# EAGLE design led_flasher_v1 (EAGLE 7.1.0)
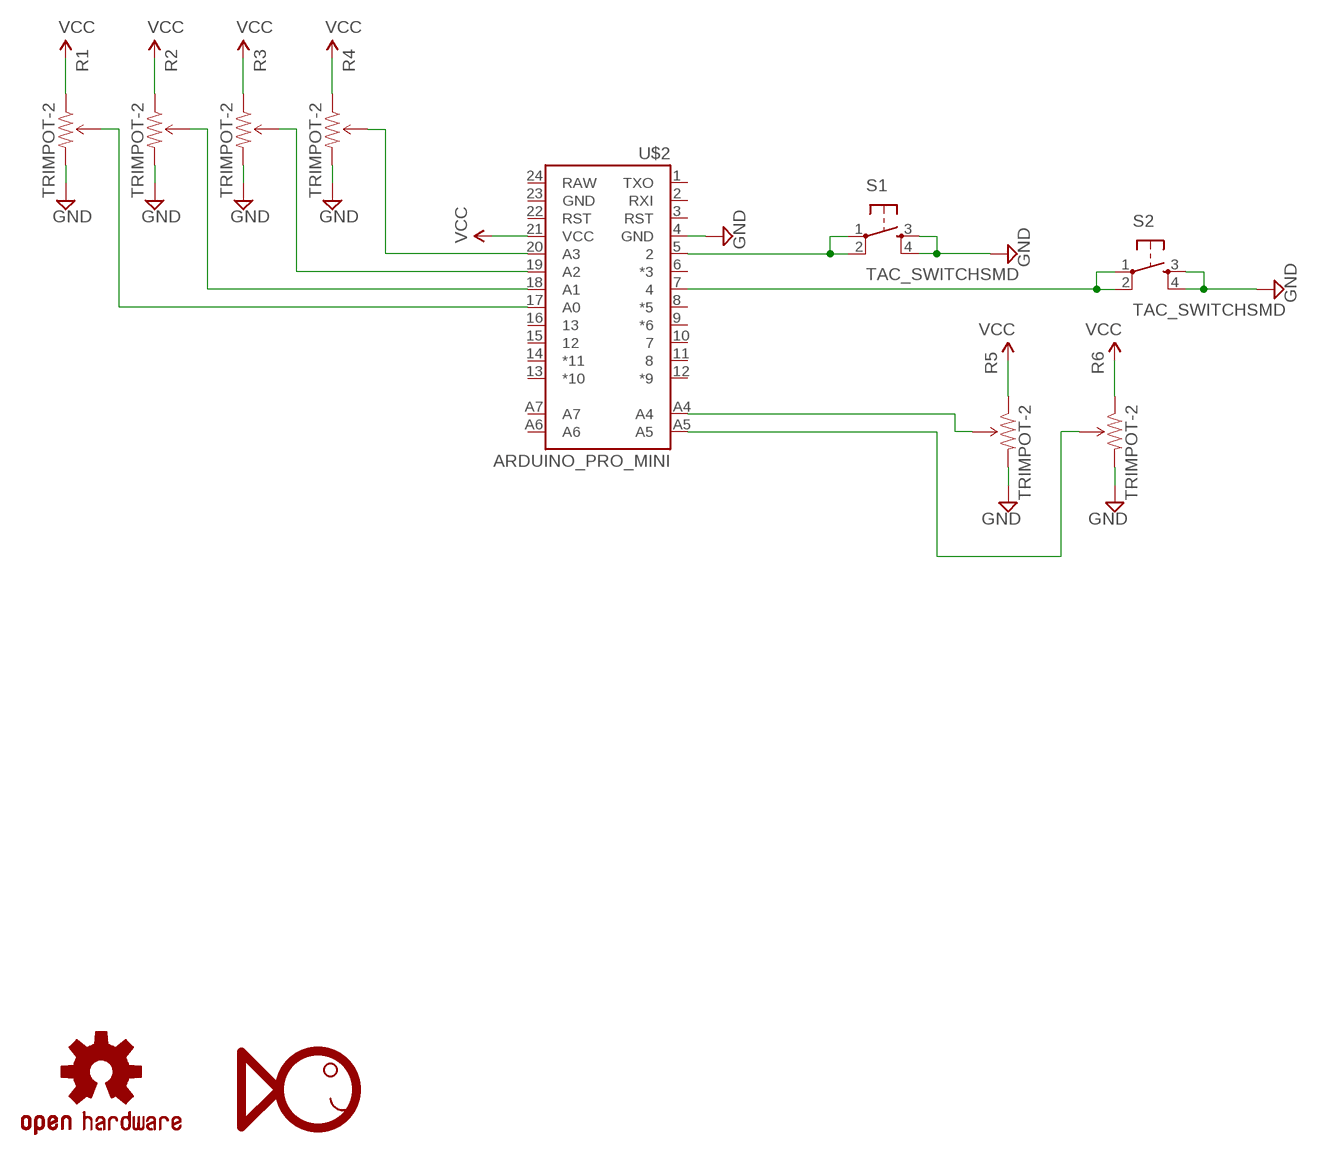
[diagram p0: schematic, sheet 1]

## Parts
LOGO1  OSHW-LOGOS  [OSHW-LOGO-S]
R1  TRIMPOT-2  [TRIMPOT_TC33]
R2  TRIMPOT-2  [TRIMPOT_TC33]
R3  TRIMPOT-2  [TRIMPOT_TC33]
R4  TRIMPOT-2  [TRIMPOT_TC33]
R5  TRIMPOT-2  [TRIMPOT_TC33]
R6  TRIMPOT-2  [TRIMPOT_TC33]
S1  TAC_SWITCHSMD  [TACTILE-SWITCH-SMD]
S2  TAC_SWITCHSMD  [TACTILE-SWITCH-SMD]
U$1  FHI_LOGO  [FHI_LOGO]
U$2  ARDUINO_PRO_MINI  [ARDUINO_PRO_MINI]

## Nets
GND: R1.3(CW) R2.3(CW) R3.3(CW) R4.3(CW) R5.3(CW) R6.3(CW) S1.3 S1.4 S2.3 S2.4 U$2.4(GND)
N$1: R4.2(WIPER) U$2.20(A3)
N$2: R5.2(WIPER) U$2.A4
N$3: R6.2(WIPER) U$2.A5
N$4: R1.2(WIPER) U$2.17(A0)
N$5: R2.2(WIPER) U$2.18(A1)
N$6: R3.2(WIPER) U$2.19(A2)
N$7: S2.1 S2.2 U$2.7
N$11: S1.1 S1.2 U$2.5
VCC: R1.1(CCW) R2.1(CCW) R3.1(CCW) R4.1(CCW) R5.1(CCW) R6.1(CCW) U$2.21(VCC)
Unconnected: U$2.1(TXO) U$2.2(RXI) U$2.3(RST) U$2.6(*3) U$2.8(*5) U$2.9(*6) U$2.10 U$2.11 U$2.12(*9) U$2.13(*10) U$2.14(*11) U$2.15 U$2.16 U$2.22(RST) U$2.23(GND) U$2.24(RAW) U$2.A6 U$2.A7

## Library data of the parts
LOGO1 = SparkFun-Aesthetics:OSHW-LOGO: Open Source Hardware Logo This logo indicates the piece of hardware it is found on incorporates a OSHW license and/or adheres to the definition of open source hardware found here: http://freedomdefined.org/OSHW
R1-R6 = SparkFun-Electromechanical:TRIMPOT: Various small potentiometers for "set-and-forget" applications
S1 S2 = SparkFun-Electromechanical:TAC_SWITCH: Momentary Switch Button commonly used for reset or general input. Spark Fun Electronics SKU : COM-00097 SMT- SWCH-08247; PROD_ID: SWCH-08247
U$1 = CyberRailGuru:FHI_LOGO: Fishhead Industries Logo
U$2 = SparkFun-Boards:ARDUINO_PRO_MINI

## Board
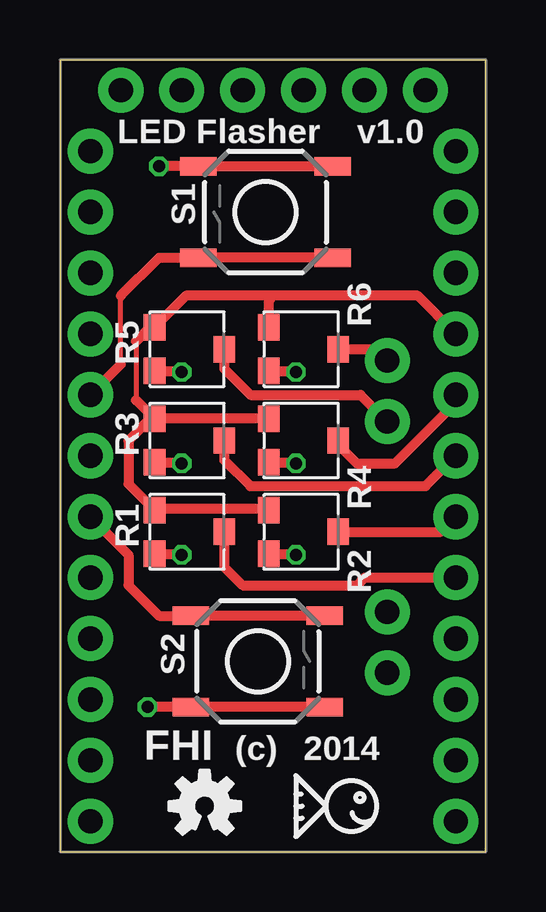
[diagram p1: board, top side]
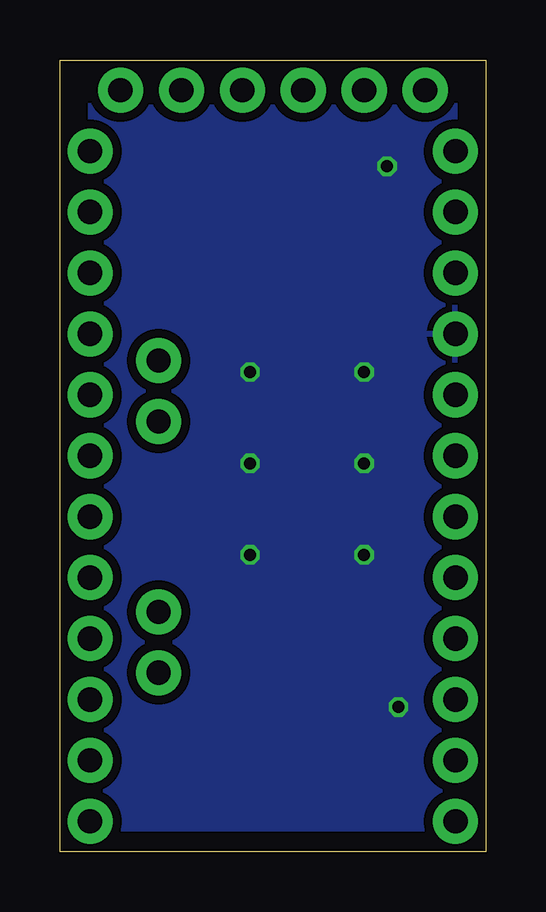
[diagram p2: board, bottom side, seen from below]

Size 17.77 x 33.01 mm. Coordinates in mm from the lower left corner, seen from the top.
Outline: 0,0 17.77,0 17.77,33.01 0,33.01 0,0
Copper layers (1*16): Top 0.035mm / dielectric 1.5mm / Bottom 0.035mm
Design rules "Fusion_eagle_rule_v1.1 *": minimum track width 6mil, minimum drill 12mil, track to track 15mil, track to pad 15mil, pad to pad 6mil, via to via 6mil, smd to smd 0mil, copper to edge 10mil, drill to drill 10mil, minimum pad ring 10mil, minimum via ring 6mil, stop-mask expansion 2mil, vias tented up to drill 100mil, thermal gap 10mil

### Footprints (pad centres in the part's own frame; a part is rotated, then mirrored left to right if it is on the bottom)
TRIMPOT_TC33 = smd 1.1 x 0.9: 1 -0.91,-1.45; 2 0,1.45; 3 0.91,-1.45
TACTILE-SWITCH-SMD = smd 1.524 x 0.762: 1 -2.794,1.905; 2 2.794,1.905; 3 -2.794,-1.905; 4 2.794,-1.905
ARDUINO_PRO_MINI = drill 1.016 pad 1.88: 1 -7.62,12.7; 2 -7.62,10.16; 3 -7.62,7.62; 4 -7.62,5.08; 5 -7.62,2.54; 6 -7.62,0; 7 -7.62,-2.54; 8 -7.62,-5.08; 9 -7.62,-7.62; 10 -7.62,-10.16; 11 -7.62,-12.7; 12 -7.62,-15.24; 13 7.62,-15.24; 14 7.62,-12.7; 15 7.62,-10.16; 16 7.62,-7.62; 17 7.62,-5.08; 18 7.62,-2.54; 19 7.62,0; 20 7.62,2.54; 21 7.62,5.08; 22 7.62,7.62; 23 7.62,10.16; 24 7.62,12.7; A4 4.763,1.429; A5 4.763,3.969; A6 4.763,-9.049; A7 4.763,-6.509; BLK -6.35,15.24; GND -3.81,15.24; GRN 6.35,15.24; RXI 1.27,15.24; TXO 3.81,15.24; VCC -1.27,15.24

### Placement (x,y rotation side)
LOGO1  6.03,1.91 0 top
R1  5.4,13.34 270 top
R2  10.16,13.34 270 top
R3  5.4,17.14 270 top
R4  10.16,17.14 270 top
R5  5.4,20.95 270 top
R6  10.16,20.95 270 top
S1  8.57,26.67 180 top
S2  8.26,7.94 0 top
U$1  11.11,1.91 0 top
U$2  8.89,16.51 0 top

### Tracks (layer width: path | path; a pad name or v marks a point on that pad's centre or on a via)
GND  (via drill 0.5)
  Top 0.406: S1.3 S1.4 v4.13,28.57 | S2.4 S2.3 v3.65,6.03 | R5.3 5.04,20.05 v5.08,20 | R3.3 5.04,16.23 v5.08,16.19 | R1.3 5.04,12.43 v5.08,12.38 | R2.3 9.8,12.43 v9.84,12.38 | R4.3 9.8,16.23 v9.84,16.19 | R6.3 9.8,20.05 v9.84,20
  pour Bottom: 1.27,31.75 16.51,31.75 16.51,0.95 1.27,0.95
N$1
  Top 0.406: R4.2 11.61,16.96 12.38,16.19 13.97,16.19 16.19,18.41 16.19,18.73 U$2.20
N$2
  Top 0.406: R5.2 6.85,20.14 7.94,19.05 12.54,19.05 U$2.A4
N$3
  Top 0.406: R6.2 13.18,20.95 U$2.A5
N$4
  Top 0.406: R1.2 6.85,11.88 7.62,11.11 12.38,11.11 12.7,11.43 U$2.17
N$5
  Top 0.406: R2.2 15.88,13.34 U$2.18
N$6
  Top 0.406: R3.2 6.85,16.33 7.94,15.24 15.24,15.24 U$2.19
N$7
  Top 0.406: S2.2 S2.1 4.13,9.84 2.86,11.11 2.86,12.38 U$2.7
N$11
  Top 0.203: 2.54,20.32 2.54,23.18
  Top 0.406: S1.1 S1.2 4.13,24.77 2.54,23.18 | U$2.5 2.54,20.32
VCC
  Top 0.203: R5.1 3.77,21.86 | 3.17,21.27 3.17,18.83 | R3.1 3.77,18.05 | R2.1 8.62,14.24 8.57,14.29 | 3.99,14.29 R1.1
  Top 0.406: U$2.21 14.92,23.18 8.89,23.18 | 8.89,23.18 5.26,23.18 R5.1 | R6.1 8.71,23 8.89,23.18 | 3.77,21.86 3.17,21.27 | 3.17,18.83 R3.1 R4.1 | 8.57,14.29 3.99,14.29 | 3.77,18.05 2.86,17.14 2.86,15.34 R1.1

### Text on the board
tPlace: LED Flasher | FHI
tNames: v1.0 | (c) | 2014